# Altium schematic sheet Power.SchDoc
size A4; SheetNumber: 4; SheetTotal: 4
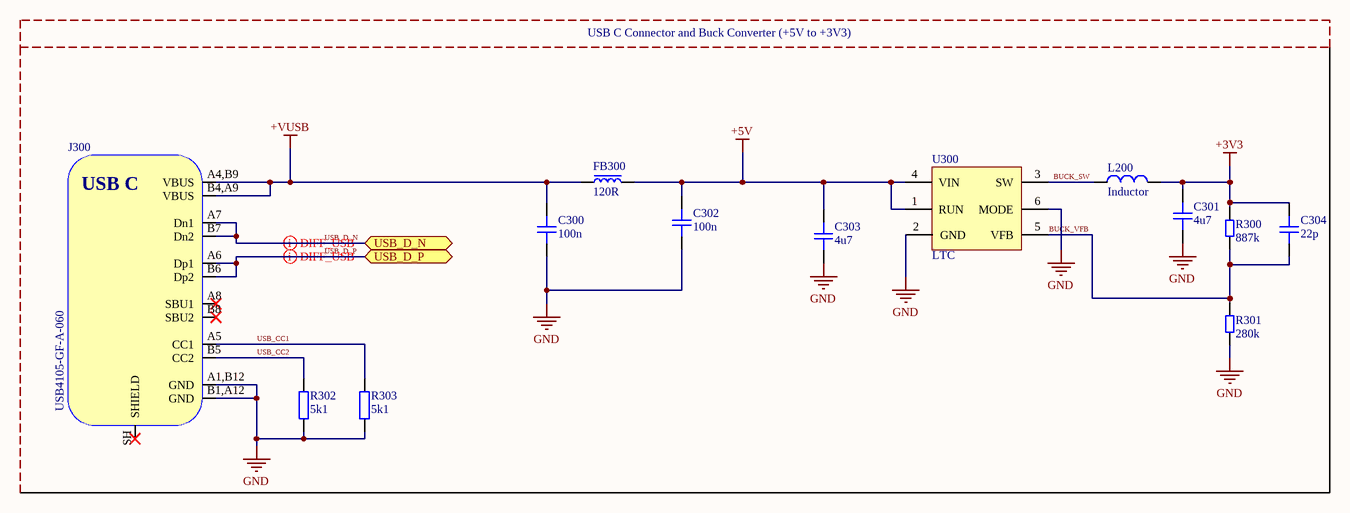
[diagram p0: Power.SchDoc]

## Parts
C300  100n  [CAP_0805]
C301  4u7  [CAP-0805-NP0]
C302  100n  [CAP_0805]
C303  4u7  [CAP_0805]
C304  22p  [CAP-0805-NP0]
FB300  120R  [FB_0603]
J300  USB4105-GF-A-060  [USB4105-GF-A-060]
L200  Inductor  [IND_0603]
R300  887k  [RES-0603]
R301  280k  [RES-0603]
R302  5k1  [RES_0603]
R303  5k1  [RES_0603]
U300  LTC  [SOT-23-6]

## Ports
USB_D_N (bidir), USB_D_P (bidir)

## Nets
+3V3: C301.2 C304.2 L200.2 R300.2
+5V: C302.2 C303.2 FB300.2 U300.1(RUN) U300.4(VIN)
+VUSB: C300.2 FB300.1 J300.A4,B9(VBUS) J300.B4,A9(VBUS)
GND: C300.1 C301.1 C302.1 C303.1 J300.A1,B12(GND) J300.B1,A12(GND) R301.1 R302.1 R303.1 U300.2(GND) U300.6(MODE)
BUCK_SW: L200.1 U300.3(SW)
BUCK_VFB: C304.1 R300.1 R301.2 U300.5(VFB)
USB_CC1: J300.A5(CC1) R303.2
USB_CC2: J300.B5(CC2) R302.2
USB_D_N: J300.A7(Dn1) J300.B7(Dn2) ; port USB_D_N
USB_D_P: J300.A6(Dp1) J300.B6(Dp2) ; port USB_D_P

Not connected (* = marked no-connect by the designer): J300 A8(SBU1)* B8(SBU2)* SH(SHIELD)*

## Layout directives
differential pair; differential pair class USB: USB_D_N, USB_D_P

## Notes on the sheet
- USB C Connector and Buck Converter (+5V to +3V3)
- V(out)= 3V3   V(in,max)=5V5   f(SW)=1.5MHz I(L,max)=300mA   I(L,rip)=0.3*I(L,max)=100mA
- V(out)*[(V(in,max)-V(out)] /  [(I(L,rip)*I(L,rip)*f(SW)*V(in,max) ]
- Ferrite Bead seçerken, rezonansları indüklememeye dikkat etmeli ve değerin uygun seçildiğinden emin olmalısın.
- (near R303) CC'leri GND'ye bağlamak, cihazın akımı senkronize etmesini sağlar.
- (in symbol USB4105-GF-A-060) USB C

## Library data of the parts
C300-C304 = CAP_0805_16V: Capacitor SMD 0805 16V
FB300 = FB_0603: Ferrite Bead SMD 0603
J300 = USB4105-GF-A-060: USB Connector Type C SMT 12 Pin; Manufacturer: GCT; Manufacturer Part Number: USB4105-GF-A-060
R300 R301 = RES-0603-1k: 贴片电阻 1000Ω ± 1.00% 0.1W ± 100ppm/℃ 0603; Manufacturer: Vishay Dale; Manufacturer Part Number: CRCW06031K00FKEA; Resistance: 1kR; Power Rating: 100mW; Temperature Coefficient: 100ppm/°C; Tolerance: 1%; Voltage Rating: 75V; Supplier 1: Newark; RoHS: Yes; Category: Chip SMD Resistors; Pricing 1: 1=0,12500, 10=0,05300, 25=0,04300, 50=0,03100, 100=0,02100 (USD); Mount: Surface Mount; Case/Package: 0603; Number of Pins: 2; Case Code (Metric): 1608; Case Code (Imperial): 0603; Contact Plating: Tin; Size Code: 0603; Weight: 7.1E-05oz; Min Operating Temperature: -55°C; Max Operating Temperature: 155°C; Packaging: Tape and Reel; Max Power Dissipation: 100mW; Series: CRCW; Resistor Type: Thick Film; Package Quantity: 10; Number of Terminations: 2; Termination: SMD/SMT; Features: Automotive AEC-Q200; Construction: Rectangular; Voltage Rating (DC): 75V; Resistance Tolerance: 1%; Technology: THICK FILM; Length: 1.55mm; Width: 0.033inch; Height: 0.45mm; Depth: 0.85mm; Radiation Hardening: No; Lead Free: Lead Free; RoHS Compliant: Yes; Military Standard: Not; REACH SVHC: Unknown; ComponentLink1URL: https://datasheet.ciiva.com/11808/0900766b80d98afc-11808625.pdf?src-supplier=RSComponents; ComponentLink1Description: https://datasheet.ciiva.com/11808/0900766b80d98afc-11808625.pdf?src-supplier=RSComponents; ComponentLink2URL: https://datasheet.ciiva.com/46441/1720486-46441623.pdf?src-supplier=Element14; ComponentLink2Description: https://datasheet.ciiva.com/46441/1720486-46441623.pdf?src-supplier=Element14; ComponentLink3URL: https://datasheet.ciiva.com/46441/1720486-46441622.pdf?src-supplier=Element14; ComponentLink3Description: https://datasheet.ciiva.com/46441/1720486-46441622.pdf?src-supplier=Element14; ComponentLink4URL: https://datasheet.ciiva.com/26316/fld-crcw-e3-data-en-26316551.pdf?src-supplier=Distrelec; ComponentLink4Description: https://datasheet.ciiva.com/26316/fld-crcw-e3-data-en-26316551.pdf?src-supplier=Distrelec; ComponentLink5URL: https://datasheet.ciiva.com/46385/1697337-46385497.pdf?src-supplier=Element14; ComponentLink5Description: https://datasheet.ciiva.com/46385/1697337-46385497.pdf?src-supplier=Element14; ComponentLink6URL: https://datasheet.ciiva.com/2465/dcrcwe3-2465535.pdf?src-supplier=Digi-Key; ComponentLink6Description: https://datasheet.ciiva.com/2465/dcrcwe3-2465535.pdf?src-supplier=Digi-Key; ComponentLink7URL: https://datasheet.ciiva.com/2465/dcrcwe3-2465536.pdf?src-supplier=Digi-Key; ComponentLink7Description: https://datasheet.ciiva.com/2465/dcrcwe3-2465536.pdf?src-supplier=Digi-Key; ComponentLink8URL: https://datasheet.ciiva.com/2465/dcrcwe3-2465534.pdf?src-supplier=Digi-Key; ComponentLink8Description: https://datasheet.ciiva.com/2465/dcrcwe3-2465534.pdf?src-supplier=Digi-Key; ComponentLink9URL: https://datasheet.ciiva.com/16515/dcrcwe3-16515078.pdf?src-supplier=Avnet+Asia; ComponentLink9Description: https://datasheet.ciiva.com/16515/dcrcwe3-16515078.pdf?src-supplier=Avnet+Asia; ComponentLink10URL: https://datasheet.ciiva.com/8336/dcrcwe3-8336822.pdf?src-supplier=Avnet; ComponentLink10Description: https://datasheet.ciiva.com/8336/dcrcwe3-8336822.pdf?src-supplier=Avnet; ComponentLink11URL: https://datasheet.ciiva.com/16199/dcrcwe3-16199053.pdf?src-supplier=Future+Electronics; ComponentLink11Description: https://datasheet.ciiva.com/16199/dcrcwe3-16199053.pdf?src-supplier=Future+Electronics; ComponentLink12URL: https://datasheet.ciiva.com/16893/dcrcwe3-16893742.pdf?src-supplier=Avnet+Europe; ComponentLink12Description: https://datasheet.ciiva.com/16893/dcrcwe3-16893742.pdf?src-supplier=Avnet+Europe; ComponentLink13URL: https://datasheet.ciiva.com/3257/dcrcwe3-3257132.pdf?src-supplier=Avnet; ComponentLink13Description: https://datasheet.ciiva.com/3257/dcrcwe3-3257132.pdf?src-supplier=Avnet; Supplier Part Number 1: 61M5328
R302 R303 = RES_0603: Resistor SMD 0603
U300 = LTC3405: 1.5MHz, 300mA Synchronous Step-Down Regulator in ThinSOT; Manufacturer: Analog Devices; Manufacturer Part Number: LTC3405ES6#TRMPBF